# Altium schematic sheet Sch_Fuente.SchDoc: Control de Domótica
size A4; Author: Francisco González González - Eugenia Ipar; CompanyName: Fuente de Alimentación; DocumentNumber: 3; SheetNumber: 3; SheetTotal: 12; Materia: Técnicas Digitales II; Placa: Fuente de Alimentación; Year: 2015; Prof1: Prof: Alarcón, Juan; Prof2: Ayud: Crivelli, Marcelo; Prof3: Ayud: Montalti, Pablo; PageSetup: Record=PageOptions|CenterHorizontal=True|CenterVertical=True|PrintScale=1.00|XCorrection=1.00|YCorrection=1.00|PrintKind=0|BorderSize=5000000|LeftOffset=0|BottomOffset=0|Orientation=2|PaperLength=1000|PaperWidth=1000|Scale=100|PaperSource=7|PrintQuality=-3|MediaType=1|DitherType=10|PrintScaleMode=1|PaperKind=A4|PaperIndex=9
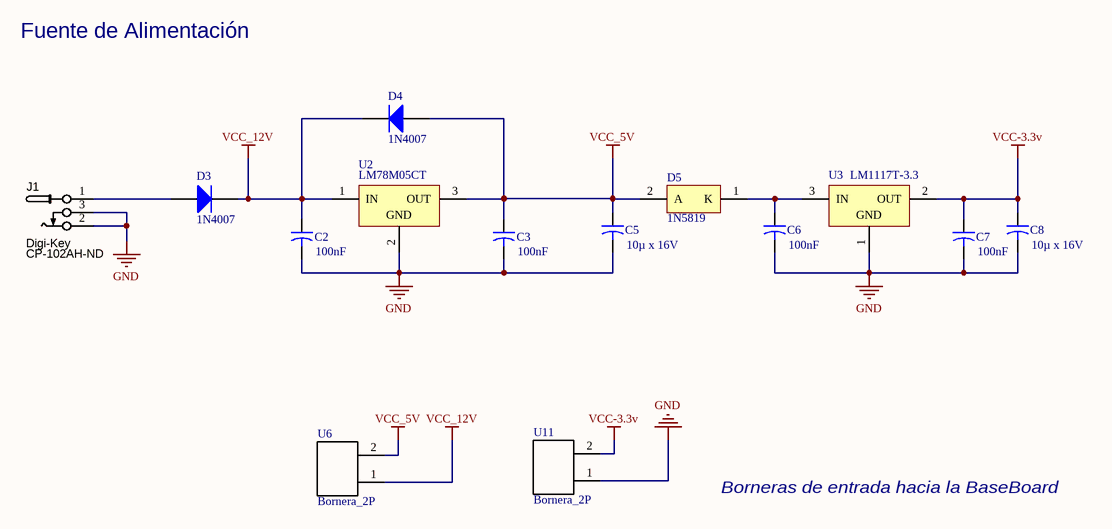
[diagram p0: Sch_Fuente.SchDoc]

## Parts
C2  value 100nF  [CAPR5-4X5]  (hidden comment: Cap2)
C3  value 100nF  [CAPR5-4X5]  (hidden comment: Cap2)
C5  value 10µ x 16V  [CAPR5-4X5]  (hidden comment: Cap2)
C6  value 100nF  [CAPR5-4X5]  (hidden comment: Cap2)
C7  value 100nF  [CAPR5-4X5]  (hidden comment: Cap2)
C8  value 10µ x 16V  [CAPR5-4X5]  (hidden comment: Cap2)
D3  1N4007  [DO-41]
D4  1N4007  [DO-41]
D5  1N5819  [ONSC-AXIAL_LEAD-2-59-10_P]
J1  Supplier 1: Digi-Key  Supplier Part Number 1: CP-102AH-ND  [CONN_PWR_JACK_2.1x5.5mm]  (hidden comment: CONN_PWR_JACK_2.1x5.5mm)
U2  LM78M05CT  [T03B]
U3  LM1117T-3.3  [T03B]
U6  Bornera_2P  [Bornera]
U11  Bornera_2P  [Bornera]

## Nets
GND: C2.2 C3.2 C5.2 C6.2 C7.2 C8.2 J1.2 J1.3 U2.2(GND) U3.1(GND) U11.1
VCC-3.3v: C7.1 C8.1 U3.2(OUT) U11.2
VCC_5V: C3.1 C5.1 D4.1(A) D5.2(A) U2.3(OUT) U6.2
VCC_12V: C2.1 D3.2(K) D4.2(K) U2.1(IN) U6.1
NetC6_1: C6.1 D5.1(K) U3.3(IN)
NetD3_1: D3.1(A) J1.1

## Notes on the sheet
- Fuente de Alimentación
- Borneras de entrada hacia la BaseBoard
- Sheet
- of

## Library data of the parts
C2 C3 C5-C8 = Cap2: Capacitor; Published: 23-Sep-2002; PackageReference: CAPR5-4X5; Publisher: Altium Limited; PackageDescription: Capacitor; 2 Leads
D3 D4 = Diode 1N4007: 1 Amp General Purpose Rectifier; Published: 8-Jun-2000; LatestRevisionDate: 17-Jul-2002; LatestRevisionNote: Re-released for DXP Platform.; DatasheetVersion: 1998; PackageVersion: Aug-1999; PackageReference: DO-41; Publisher: Altium Limited; PackageDescription: Diode, Axial; Body 5.2 x 2.7 mm (LxDia. max), Lead Dia. 0.86 mm (max); Code_JEDEC: DO-204-AL; ComponentLink1Description: Manufacturer Link; ComponentLink1URL: http://www.fairchildsemi.com/; ComponentLink2Description: Datasheet; ComponentLink2URL: http://www.fairchildsemi.com/ds/1N%2F1N4001.pdf
D5 = CMP-1055-00042-1: Rectifier, 2-Pin Axial_Lead, Pb-Free, Bulk Bag; Manufacturer: On Semiconductor; IFSM Max (A): 25; Configuration: Single; Note1: 0; PackageDescription: 2-Pin, Axial Lead, Diameter 2.35 mm; Mounting Technology: Through Hole; Packing: Bulk Bag; RoHS: TRUE; DatasheetVersion: Rev. 10; ComponentLink3Description: Package Specification; ComponentLink1URL: http://www.onsemi.com/; ComponentLink2Description: Datasheet; PackageReference: AXIAL_LEAD-2-59-10; ComponentLink3URL: http://www.onsemi.cn/pub_link/Collateral/59-10.PDF; PackageVersion: Rev. U, 02/2005; PartNumber: 1N5819; ComponentLink1Description: Manufacturer URL; ComponentLink2URL: http://www.onsemi.cn/pub_link/Collateral/1N5817-D.PDF
J1 = CONN_PWR_JACK_2.1x5.5mm: Power Connector, THT, 2.1mm ID, 5.5mm OD; Manufacturer 1: CUI Inc; Manufacturer Part Number 1: PJ-102AH; SCDType: undef; Category: Connectors; Mounting Type: Through Hole; Package / Case: PCB mount; Value: 2.1mm ID, 5.5mm OD
U2 = CMP-0062-02484-2: 3-Terminal Positive Voltage Regulators, 3-pin TO-220; Manufacturer: National Semiconductor; PowerWise: N; PackageTopMarking: NSUZXYTTE#*LM341T-5.0*LM78M05CT; CompType: LDO IC; ComponentLink3Description: T03B Package Page; ComponentLink1URL: http://www.national.com/ds/LM/LM78M05.pdf; PinCount: 3; PackageVersion: revL, Jan-1992; PackageReference: T03B; ComponentLink1Description: LM78M05 Datasheet; ComponentLink2Description: LM78M05 Web Page; ComponentLink3URL: http://www.national.com/packaging/folders/t03b.html; RevisionNote: Component URLs added; PackageDescription: TO-220, Molded, 3 Lead, Straight; RoHS: N; DatasheetVersion: Aug-2005; ComponentLink2URL: http://www.national.com/pf/LM/LM78M05.html
U3 = CMP-0062-02490-2: 800mA Low-Dropout Linear Regulator, 3-pin TO-220; Manufacturer: National Semiconductor; PowerWise: N; CompType: LDO IC; PackageTopMarking: NSUZXYTTE#*LM1117T*3.3; ComponentLink1Description: LM1117 Datasheet; RoHS: N; PinCount: 3; DatasheetVersion: Apr-2006; PackageDescription: TO-220, Molded, 3 Lead, Straight; ComponentLink2URL: http://www.national.com/pf/LM/LM1117.html; ComponentLink2Description: LM1117 Web Page; RevisionNote: Component URLs added; ComponentLink3Description: T03B Package Page; PackageReference: T03B; ComponentLink1URL: http://www.national.com/ds/LM/LM1117.pdf; PackageVersion: revL, Jan-1992; ComponentLink3URL: http://www.national.com/packaging/folders/t03b.html